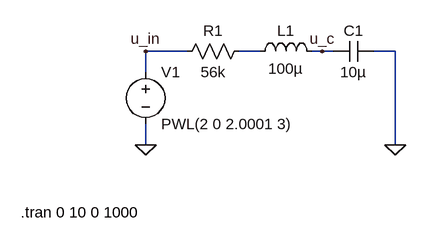
[diagram p0: schematic RLC_serial.asc]
RLC_serial.asc, the LTspice schematic file:
Version 4.1
SHEET 1 880 680
WIRE 80 80 16 80
WIRE 192 80 160 80
WIRE 288 80 272 80
WIRE 304 80 288 80
WIRE 400 80 368 80
WIRE 16 112 16 80
WIRE 16 224 16 192
WIRE 400 224 400 80
FLAG 16 224 0
FLAG 400 224 0
FLAG 16 80 u_in
FLAG 288 80 u_c
SYMBOL voltage 16 96 R0
WINDOW 123 0 0 Left 0
WINDOW 39 0 0 Left 0
SYMATTR InstName V1
SYMATTR Value PWL(2 0 2.0001 3)
SYMBOL res 176 64 R90
WINDOW 0 0 56 VBottom 2
WINDOW 3 32 56 VTop 2
SYMATTR InstName R1
SYMATTR Value 56k
SYMBOL ind 176 96 R270
WINDOW 0 32 56 VTop 2
WINDOW 3 5 56 VBottom 2
SYMATTR InstName L1
SYMATTR Value 100µ
SYMBOL cap 368 64 R90
WINDOW 0 0 32 VBottom 2
WINDOW 3 32 32 VTop 2
SYMATTR InstName C1
SYMATTR Value 10µ
TEXT -176 328 Left 2 !.tran 0 10 0 1000

The netlist it stands for:
* RLC_serial.asc
V1 u_in 0 PWL(2 0 2.0001 3)
R1 N001 u_in 56k
L1 N001 u_c 100µ
C1 0 u_c 10µ
.tran 0 10 0 1000
.backanno
.end

* Results of the author's LTspice run, read from the files saved beside the schematic
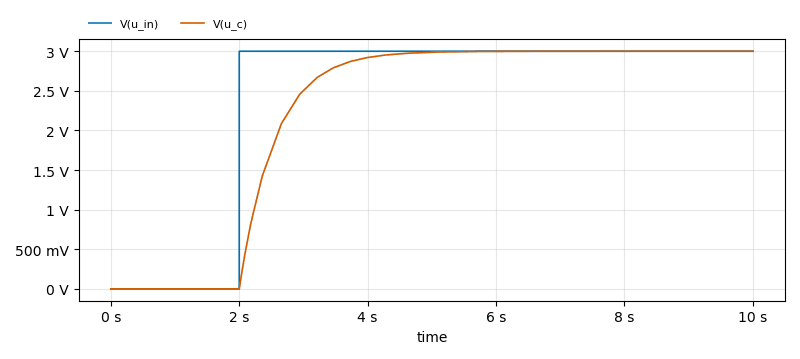
[diagram p1: Transient Analysis of RLC_serial.asc, plotted from the saved traces]
* Transient Analysis, 1 run:
*   V(u_in): min 0 V, max 3 V, average 2.4 V, rms 2.683 V, last 3 V
*   V(u_c): min 0 V, max 3 V, average 2.232 V, rms 2.54 V, last 3 V